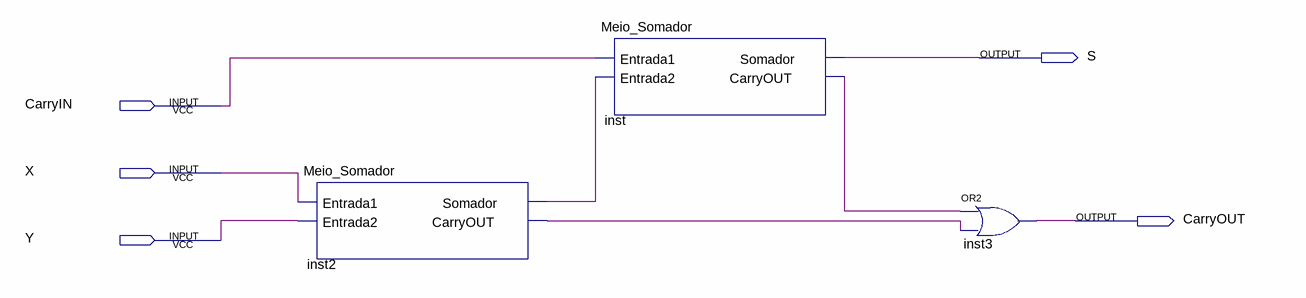
[diagram p0: schematic sheet]
// Quartus schematic Somador_Completo.bdf as structural Verilog: 3 symbols, 5 pins
module Somador_Completo (
  input  CarryIN,
  input  X,
  input  Y,
  output S,
  output CarryOUT
);

  wire inst2_carryout, inst2_somador, inst_carryout;

  Meio_Somador inst2 (.Entrada1(X), .Entrada2(Y), .Somador(inst2_somador), .CarryOUT(inst2_carryout));
  Meio_Somador inst (.Entrada1(CarryIN), .Entrada2(inst2_somador), .Somador(S), .CarryOUT(inst_carryout));
  or inst3 (CarryOUT, inst_carryout, inst2_carryout);
endmodule
